# EAGLE design eth_conn1 (EAGLE 7.2.0)
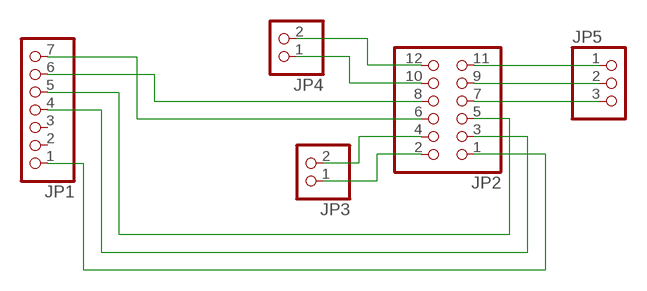
[diagram p0: schematic, sheet 1]

## Parts
JP1  PINHD-1X7  [1X07]
JP2  PINHD-2X6  [2X06]
JP3  PINHD-1X2  [1X02]
JP4  PINHD-1X2  [1X02]
JP5  PINHD-1X3  [1X03]

## Nets
N$1: JP1.1 JP2.1
N$2: JP1.4 JP2.3
N$3: JP1.5 JP2.5
N$4: JP1.6 JP2.8
N$5: JP1.7 JP2.6
N$6: JP2.4 JP3.2
N$7: JP2.2 JP3.1
N$8: JP2.12 JP4.2
N$9: JP2.10 JP4.1
N$10: JP2.11 JP5.1
N$11: JP2.9 JP5.2
N$12: JP2.7 JP5.3
Unconnected: JP1.2 JP1.3

## Library data of the parts
JP1 = pinhead:PINHD-1X7: PIN HEADER
JP2 = pinhead:PINHD-2X6: PIN HEADER
JP3 JP4 = pinhead:PINHD-1X2: PIN HEADER
JP5 = pinhead:PINHD-1X3: PIN HEADER

## Board
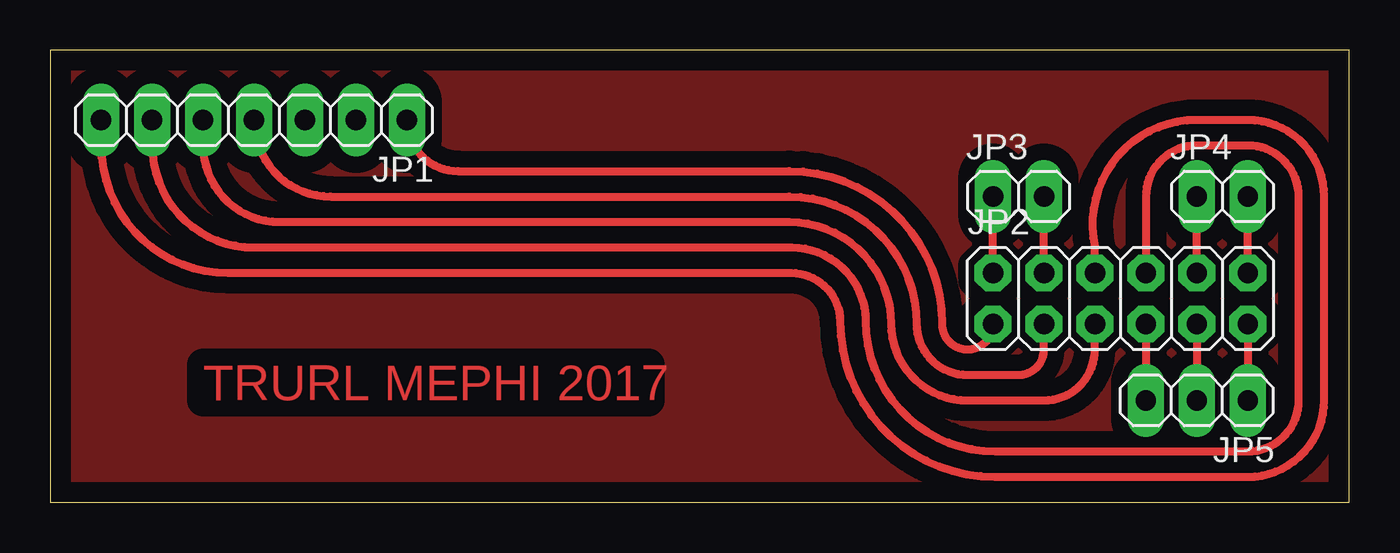
[diagram p1: board, top side]

Size 64.75 x 22.53 mm. Coordinates in mm from the lower left corner, seen from the top.
Outline: 0,0 64.75,0 64.75,22.53 0,22.53 0,0
Copper layers (1*16): Top 0.035mm / dielectric 1.5mm / Bottom 0.035mm
Design rules "default *": minimum track width 10mil, minimum drill 24mil, track to track 8mil, track to pad 8mil, pad to pad 8mil, via to via 8mil, smd to smd 8mil, copper to edge 40mil, drill to drill 8mil, minimum pad ring 16mil, minimum via ring 8mil, stop-mask expansion 4mil, vias tented up to drill 0mil, thermal gap 10mil

### Footprints (pad centres in the part's own frame; a part is rotated, then mirrored left to right if it is on the bottom)
1X07 = drill 1.016 long: 1 -7.62,0; 2 -5.08,0; 3 -2.54,0; 4 0,0; 5 2.54,0; 6 5.08,0; 7 7.62,0
2X06 = drill 1.016 octagon: 1 -6.35,-1.27; 2 -6.35,1.27; 3 -3.81,-1.27; 4 -3.81,1.27; 5 -1.27,-1.27; 6 -1.27,1.27; 7 1.27,-1.27; 8 1.27,1.27; 9 3.81,-1.27; 10 3.81,1.27; 11 6.35,-1.27; 12 6.35,1.27
1X02 = drill 1.016 long: 1 -1.27,0; 2 1.27,0
1X03 = drill 1.016 long: 1 -2.54,0; 2 0,0; 3 2.54,0

### Placement (x,y rotation side)
JP1  10.16,19.05 180 top
JP2  53.34,10.16 0 top
JP3  48.26,15.24 0 top
JP4  58.42,15.24 0 top
JP5  57.15,5.08 180 top

### Tracks (layer width: path | path; a pad name or v marks a point on that pad's centre or on a via)
N$1
  Top 0.406: JP1.1 arc90 20.32,16.51 36.83,16.51 arc-90 44.45,8.89 arc90 45.72,7.62 arc90 JP2.1
N$2
  Top 0.406: JP1.4 arc90 13.97,15.24 36.83,15.24 arc-90 43.18,8.89 arc90 45.72,6.35 48.26,6.35 arc90 49.53,7.62 JP2.3
N$3
  Top 0.406: JP1.5 7.62,17.78 arc90 11.43,13.97 36.83,13.97 arc-90 41.91,8.89 arc90 45.72,5.08 49.53,5.08 arc90 52.07,7.62 JP2.5
N$4
  Top 0.406: JP1.6 5.08,17.78 arc90 10.16,12.7 36.96,12.7 arc-90 40.64,9.02 arc90 47.12,2.54 59.69,2.54 arc90 62.23,5.08 62.23,15.24 arc90 59.69,17.78 57.15,17.78 arc90 54.61,15.24 JP2.8
N$5
  Top 0.406: JP1.7 2.54,17.78 arc90 8.89,11.43 36.94,11.43 arc-90 39.37,8.99 arc90 47.09,1.27 59.69,1.27 arc90 63.5,5.08 63.5,15.24 arc90 59.69,19.05 57.15,19.05 arc103 52.07,12.7 JP2.6
N$6
  Top 0.406: JP2.4 JP3.2
N$7
  Top 0.406: JP2.2 JP3.1
N$8
  Top 0.406: JP2.12 JP4.2
N$9
  Top 0.406: JP2.10 JP4.1
N$10
  Top 0.406: JP2.11 JP5.1
N$11
  Top 0.406: JP2.9 JP5.2
N$12
  Top 0.406: JP2.7 JP5.3
N$13
  pour Top (isolate 0.813): 0,0 64.77,0 64.77,22.86 0,22.86

### Text on the board
Top: TRURL MEPHI 2017